# Altium schematic sheet ReflectanceSensor.SchDoc
size A4; SheetNumber: 2; SheetTotal: 2
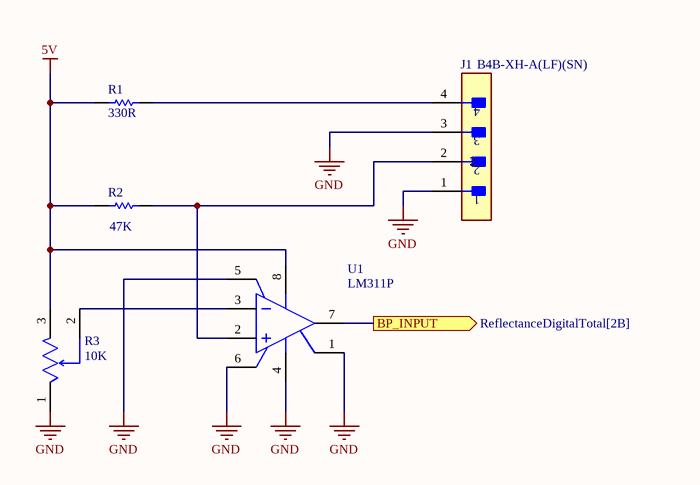
[diagram p0: ReflectanceSensor.SchDoc]

## Parts
J1  B4B-XH-A(LF)(SN)  [FP-B4B-XH-A_LF_SN-MFG]
R1  330R  [RESA60-630X240]
R2  47K  [RESA60-630X240]
R3  10K  [FP-3296W-MFG]
U1  LM311P  [FP-P0008A-MFG]

## Ports
BP_INPUT (out, see ReflectanceDigitalTotal[2B])

## Nets
5V: R1.1 R2.1 R3.3(CW) U1.8(VCC+)
GND: J1.1 J1.3 R3.1(CCW) U1.1(EMIT_OUT) U1.4(VCC-) U1.5(BALANCE) U1.6(BAL/STRB)
BP_INPUT: U1.7(COL_OUT) ; port BP_INPUT
NetJ1_2: J1.2 R2.2 U1.2(IN+)
NetJ1_4: J1.4 R1.2
NetR3_2: R3.2(WIPER) U1.3(IN-)

## Library data of the parts
J1 = CMP-17439-000250-1: CONN HEADER VERT 4POS 2.5MM; Number of Contacts: 4; Contact Resistance: 20mR; Voltage Rating: 250V; Max Current Rating: 3A; Gender: Male; Wire/Cable Gauge: 22AWG; Mated Stacking Heights: 9.8mm; Insulation Resistance: 1GR; Orientation: Straight; Contact Type: Male Pin; Contact Finish - Mating: TIN; Series: XH; Max Voltage Rating (AC): 250V; Lead Pitch: 2.5mm; Contact Shape: Square; Insulation Color: Natural; Termination: Solder; Lead Free: Lead Free; Voltage Rating (AC): 250V; Number of Rows: 1; Flammability Rating: UL94 V-0; Number of Positions: 4; Max Operating Temperature: 85°C; Package Quantity: 500; Mount: Through Hole; REACH SVHC: No SVHC; Connector Type: Header; Insulation Material: Nylon; Fastening Type: Detent; Min Operating Temperature: -25°C; Housing Color: White; Packaging: Bulk; Contact Plating: Tin; Contact Material: Brass; Max Voltage Rating (DC): 250V; Housing Material: Polyamide; Color: Natural; Material: Polyamide; Pitch: 2.5mm; Depth: 5.75mm; Current Rating: 3A; Length: 12.4mm
R1 R2 = CMP-1659-00073-1: Axial Resistor, 100 KOhm, +/- 1%, 0.25 W, -55 to 155 degC, 2-Pin THD, RoHS, Bulk; Voltage Rating: 250 V; Power Rating: 250 mW; Resistance: 475 Ohm; PackageDescription: 2-Pin Axial Lead, Dia 2.4 mm, Body Length 6.3 mm; PackageReference: MFR-25; Length: 0.248 inch; ComponentLink2Description: Datasheet; Packaging: Bulk; DatasheetVersion: Apr-13; Package Quantity: 200; Min Operating Temperature: -55 degC; ComponentLink2URL: http://www.yageo.com/documents/recent/Yageo%20LR_MFR_2013.pdf; RoHSCompliant: true; ComponentLink1URL: http://www.yageo.com/; Tolerance: 1%; Case\Package: Axial; Mount: Through Hole; ComponentLink1Description: Manufacturer URL; Max Operating Temperature: 155 degC
R3 = CMP-2000-05582-2: TRIMMER 2K OHM 0.5W PC PIN TOP; Resistance Tolerance: 10%; Max Power Dissipation: 500mW; Number of Turns: 25; Temperature Coefficient: 100ppm/°C; Resistance: 2kR; Taper: Linear; Width: 9.53mm; Radiation Hardening: No; Length: 9.53mm; Packaging: Rail/Tube; Lead Free: Lead Free; Mount: Panel; Min Operating Temperature: -55°C; Power Rating: 500mW; RoHS Compliant: Yes; REACH SVHC: No SVHC; Color: Blue; Package Quantity: 50; Contact Plating: Tin; Weight: 0.03oz; Technology: CERMET; Max Operating Temperature: 125°C; Tolerance: 10%; Termination: Pin; Resistor Type: Cermet; Military Standard: Not; Height: 0.395inch; Series: 3296; Depth: 4.83mm
U1 = CMP-1685-00016-2: Manufacturer Lifecycle Status: ACTIVE; NexarPartId: 24336; Output Type: TTL; Max Output Voltage: 7.5mV; Min Supply Voltage: 3.5V; Min Dual Supply Voltage: 1.75V; Max Supply Current: 7.5mA; Number of Elements: 1; Response Time: 165ns; Max Dual Supply Voltage: 15V; Max Supply Voltage: 30V; Max Junction Temperature (Tj): 150°C; Max Power Dissipation: 500mW; Input Offset Voltage (Vos): 2mV; Resistance: 390Ω; Operating Supply Voltage: 28V; Power Rating: 100mW; Dual Supply Voltage: 9V; Output Current per Channel: 50mA; Turn-On Delay Time: 115ns; Tolerance: 1%; Voltage Gain: 106.02dB; Input Bias Current: 250nA; Voltage Rating: 75V; Contact Plating: Gold; Case Code (Imperial): 0603; Number of Circuits: 1; Lifecycle Status: Production; Ambient Temperature Range High: 70°C; Radiation Hardening: No; Quiescent Current: 7.5mA; Number of Channels: 1; Max Operating Temperature: 70°C; Height: 5.08mm; Type: General Purpose; Case Code (Metric): 1608; Mount: Surface Mount, Through Hole; Case/Package: PDIP; Thickness: 3.9mm; REACH SVHC: No SVHC; Length: 9.81mm; RoHS: Compliant; Schedule B: 8542390000, 8542390000; Lead Free: Lead Free; Min Operating Temperature: 0°C; Width: 6.35mm; Output Current: 50mA; Packaging: Tape and Reel; Nominal Supply Current: 7.5mA; Weight: 2.012816mg; Propagation Delay: 115ns; Max Input Current: 250nA; Number of Pins: 8